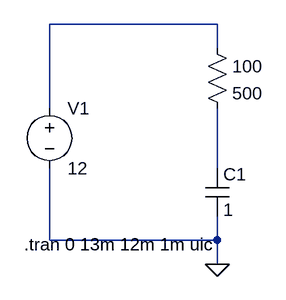
[diagram p0: schematic Draft2.asc]
Draft2.asc, the LTspice schematic file:
Version 4
SHEET 1 880 680
WIRE 240 16 16 16
WIRE 240 48 240 16
WIRE 16 128 16 16
WIRE 240 208 240 128
WIRE 16 304 16 208
WIRE 240 304 240 272
WIRE 240 304 16 304
WIRE 240 336 240 304
FLAG 240 336 0
SYMBOL voltage 16 112 R0
WINDOW 123 0 0 Left 0
WINDOW 39 0 0 Left 0
SYMATTR InstName V1
SYMATTR Value 12
SYMBOL res 224 32 R0
SYMATTR InstName 100
SYMATTR Value 500
SYMBOL cap 224 208 R0
SYMATTR InstName C1
SYMATTR Value 1
TEXT -18 310 Left 2 !.tran 0 13m 12m 1m uic

The netlist it stands for:
* Draft2.asc
V1 N001 0 12
R§100 N001 N002 500
C1 N002 0 1
.tran 0 13m 12m 1m uic
.backanno
.end